# EAGLE design SchematicV2 (EAGLE 7.7.0)
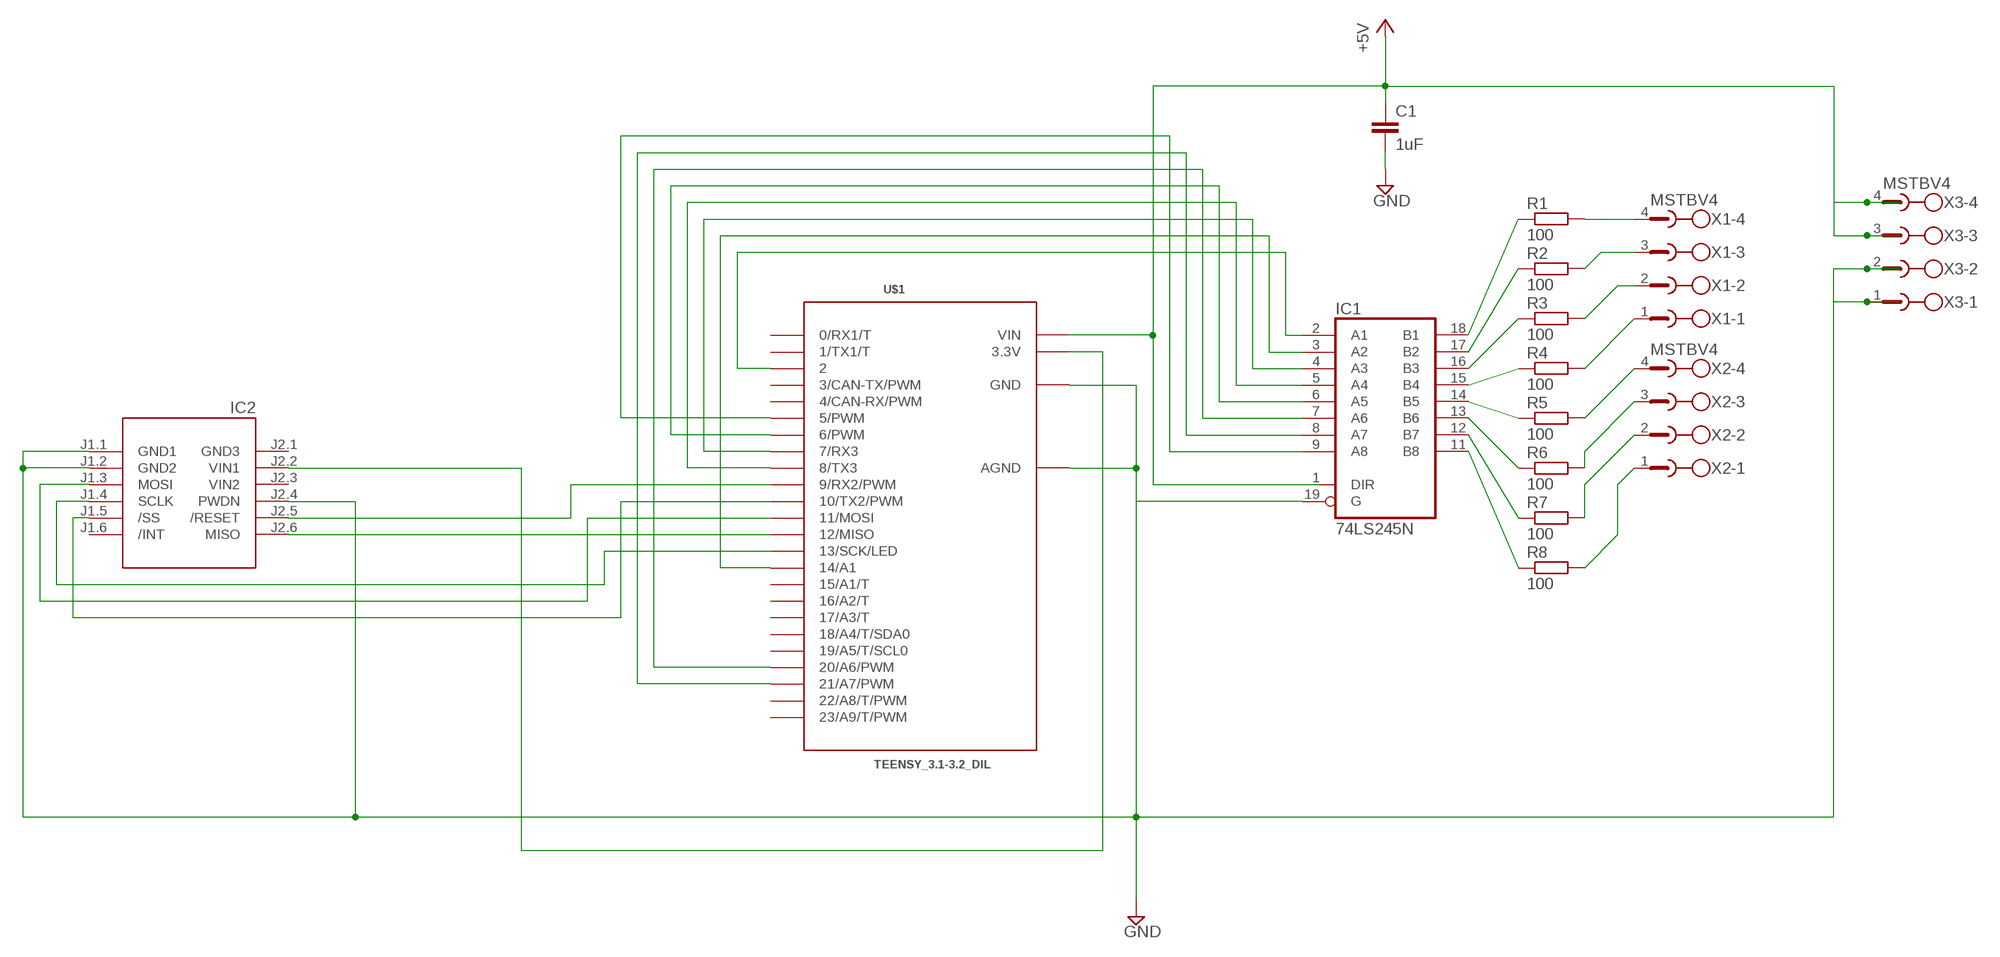
[diagram p0: schematic, sheet 1]

## Parts
C1  1uF  C-EU050-035X075  [C050-035X075]
IC1  74LS245N  [DIL20]
IC2  WIZ820IO_DEVICE'DUAL-IN-LINE'  [WIZ820IO]
R1  100  R-EU_0207/7  [0207/7]
R2  100  R-EU_0207/7  [0207/7]
R3  100  R-EU_0207/7  [0207/7]
R4  100  R-EU_0207/7  [0207/7]
R5  100  R-EU_0207/7  [0207/7]
R6  100  R-EU_0207/7  [0207/7]
R7  100  R-EU_0207/7  [0207/7]
R8  100  R-EU_0207/7  [0207/7]
U$1  TEENSY_3.1-3.2_DIL  [TEENSY_3.0-3.2&LC_DIL]
X1  MSTBV4  [MSTBV4]
X2  MSTBV4  [MSTBV4]
X3  MSTBV4  [MSTBV4]

## Nets
+5V: C1.1 U$1.VIN X3.3 X3.4
GND: C1.2 IC1.19(G) IC2.J1.1(GND1) IC2.J1.2(GND2) IC2.J2.4(PWDN) U$1.AGND U$1.GND X3.1 X3.2
N$1: IC1.18(B1) R1.1
N$2: IC1.17(B2) R2.1
N$3: IC1.16(B3) R3.1
N$4: IC1.15(B4) R4.1
N$5: IC1.14(B5) R5.1
N$6: IC1.13(B6) R6.1
N$7: IC1.12(B7) R7.1
N$8: IC1.11(B8) R8.1
N$9: IC1.2(A1) U$1.2
N$10: IC1.3(A2) U$1.14/A0(14/A1)
N$11: IC1.4(A3) U$1.7(7/RX3)
N$12: IC1.5(A4) U$1.8(8/TX3)
N$13: IC1.6(A5) U$1.6(6/PWM)
N$14: IC1.7(A6) U$1.20/A6(20/A6/PWM)
N$15: IC1.8(A7) U$1.21/A7(21/A7/PWM)
N$16: IC1.9(A8) U$1.5(5/PWM)
N$18: IC2.J2.2(VIN1) U$1.3.3V
N$19: IC2.J2.5(/RESET) U$1.9(9/RX2/PWM)
N$20: IC2.J2.6(MISO) U$1.12(12/MISO)
N$21: IC2.J1.3(MOSI) U$1.11(11/MOSI)
N$22: IC2.J1.4(SCLK) U$1.13(13/SCK/LED)
N$23: IC2.J1.5(/SS) U$1.10(10/TX2/PWM)
N$24: R1.2 X1.4
N$25: R2.2 X1.3
N$26: R3.2 X1.2
N$27: R4.2 X1.1
N$28: R5.2 X2.4
N$29: R6.2 X2.3
N$30: R7.2 X2.2
N$31: R8.2 X2.1
Unconnected: IC1.1(DIR) IC2.J1.6(/INT) U$1.0(0/RX1/T) U$1.1(1/TX1/T) U$1.3(3/CAN-TX/PWM) U$1.4(4/CAN-RX/PWM) U$1.15/A1(15/A1/T) U$1.16/A2(16/A2/T) U$1.17/A3(17/A3/T) U$1.18/A4(18/A4/T/SDA0) U$1.19/A5(19/A5/T/SCL0) U$1.22/A8(22/A8/T/PWM) U$1.23/A9(23/A9/T/PWM)

## Power pins joined to a net without a drawn wire
GND: IC1.10(GND)
GND3: IC2.J2.1(GND3)
VCC: IC1.20(VCC)
VIN2: IC2.J2.3(VIN2)

## Library data of the parts
C1 = resistor:C-EU: CAPACITOR, European symbol
IC1 = 74xx-us:74*245: Octal BUS TRANSCEIVER, 3-state
IC2 = Wiz820io:WIZ820IO_DEVICE: WIZnet, WIZ820io plug in module incl. W5200 chip and MagJack
R1-R8 = resistor:R-EU_: RESISTOR, European symbol
U$1 = Teensy_3_and_LC_Series_Boards_v1.4:TEENSY_3.1-3.2_DIL: Teensy 3.1 or 3.2 in a DIL Layout.
X1-X3 = con-phoenix-508:MSTBV4: PHOENIX; MPN: MSTBV 2,5/4-GF-5.08; OC_FARNELL: 1792794; OC_NEWARK: 69R9847

## Board
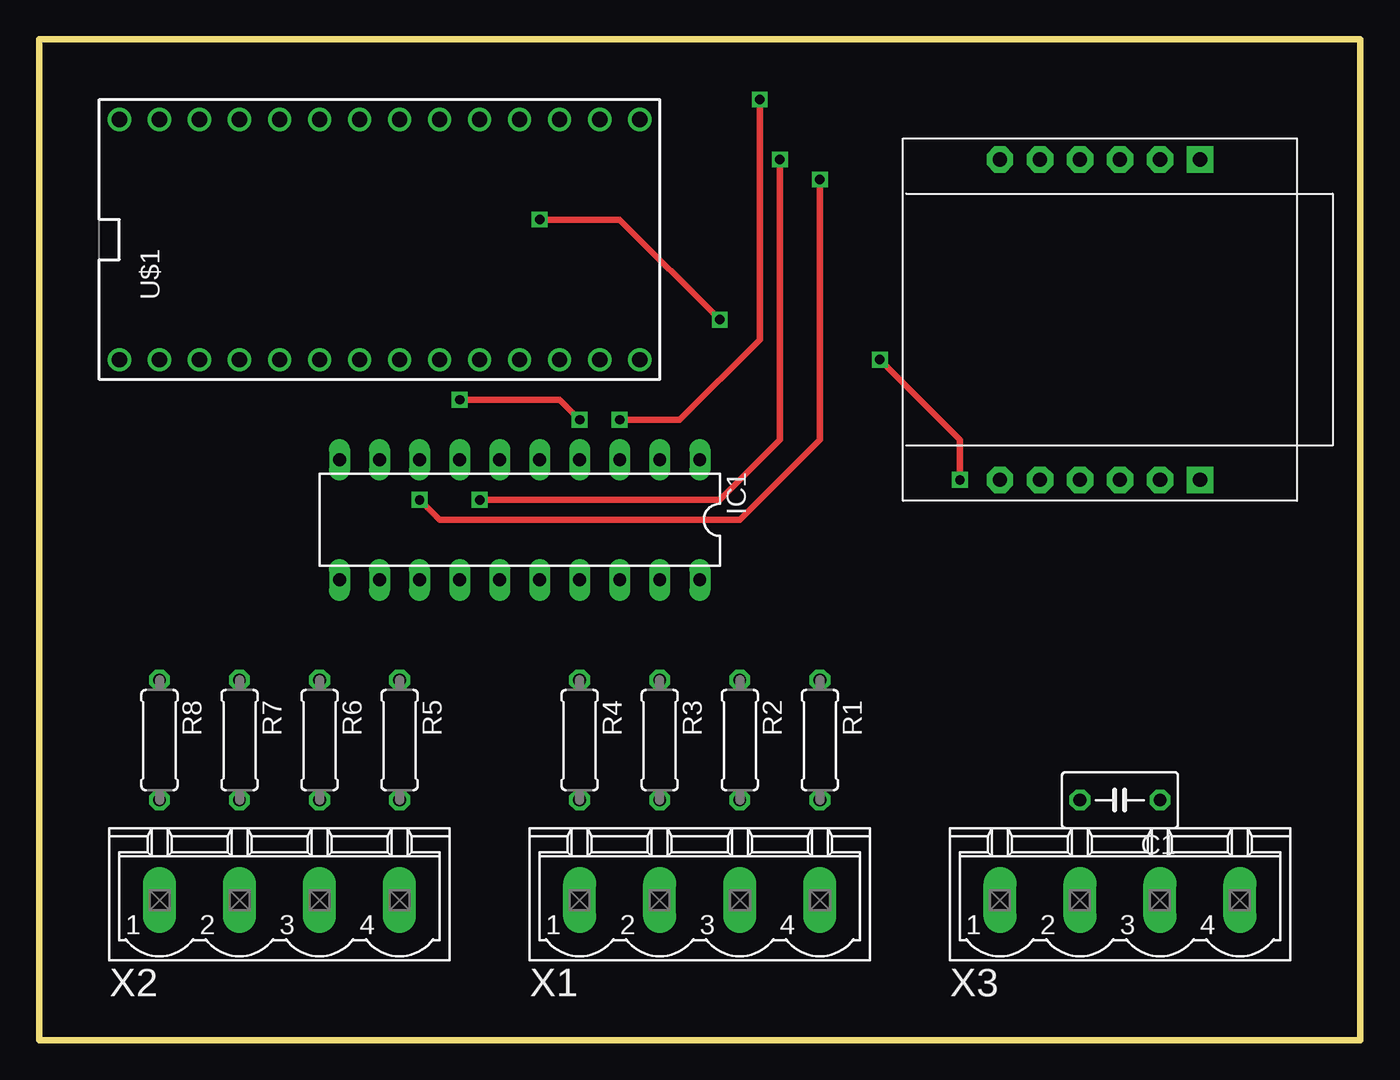
[diagram p1: board, top side]
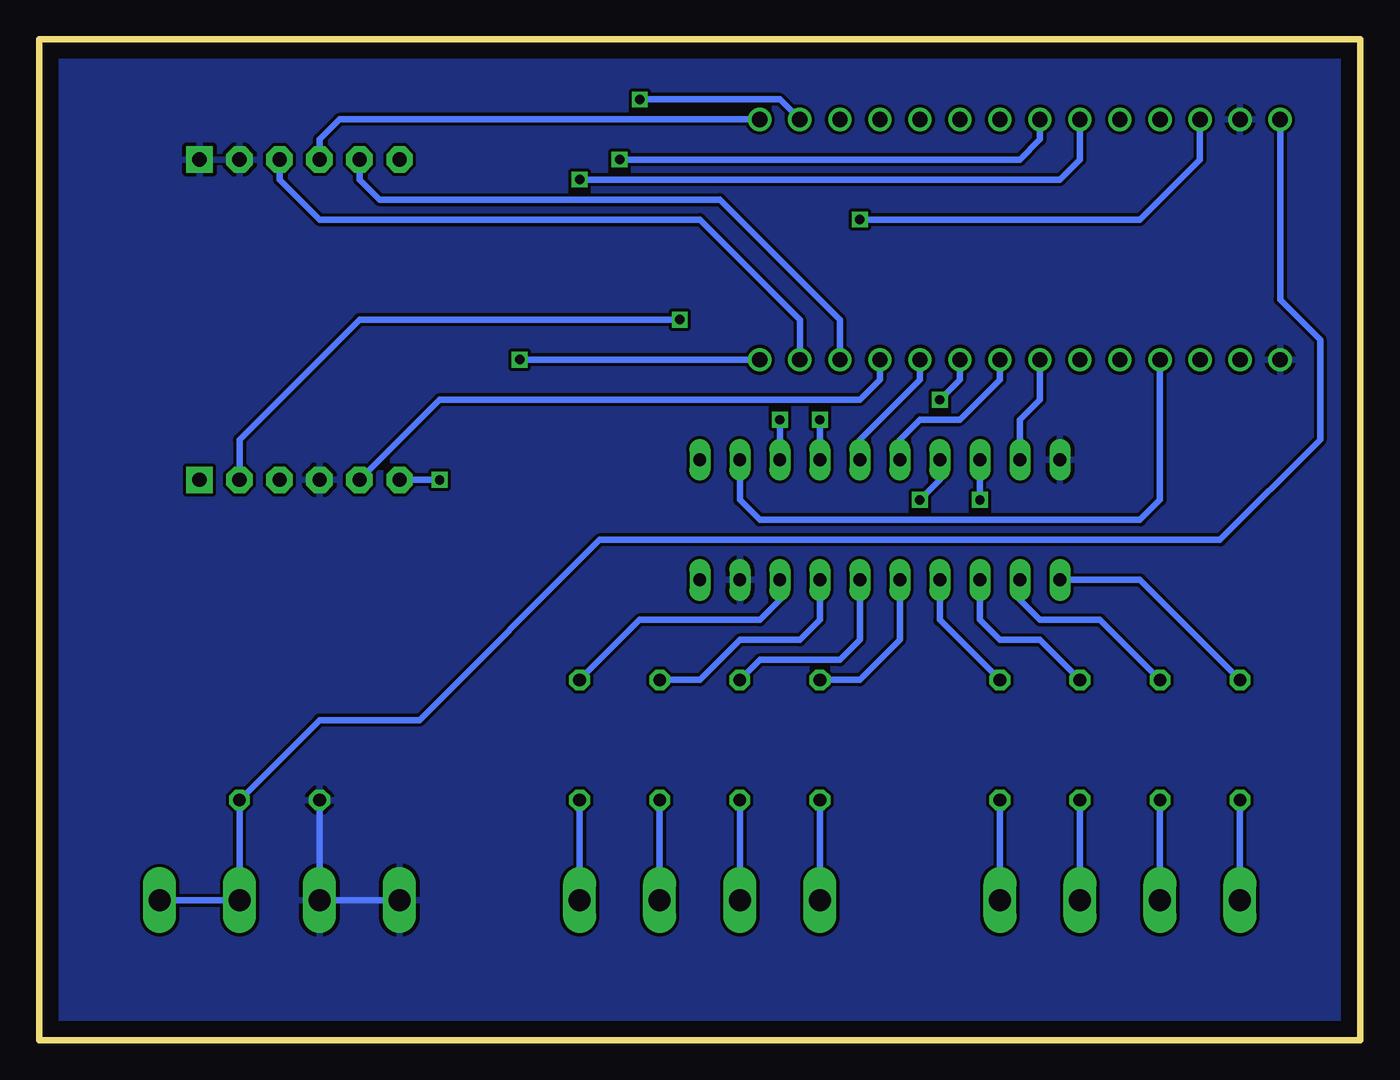
[diagram p2: board, bottom side, seen from below]

Size 83.82 x 63.5 mm. Coordinates in mm from the lower left corner, seen from the top.
Outline: 0,63.5 83.82,63.5 83.82,0 0,0 0,63.5
Copper layers (1*16): Top 0.035mm / dielectric 1.5mm / Bottom 0.035mm
Design rules "default": minimum track width 10mil, minimum drill 24mil, track to track 8mil, track to pad 8mil, pad to pad 8mil, via to via 8mil, smd to smd 8mil, copper to edge 40mil, drill to drill 8mil, minimum pad ring 10mil, minimum via ring 8mil, stop-mask expansion 4mil, vias tented up to drill 0mil, thermal gap 10mil

### Footprints (pad centres in the part's own frame; a part is rotated, then mirrored left to right if it is on the bottom)
C050-035X075 = drill 0.813 octagon: 1 -2.54,0; 2 2.54,0
DIL20 = drill 0.813 long: 1 -11.43,-3.81; 2 -8.89,-3.81; 3 -6.35,-3.81; 4 -3.81,-3.81; 5 -1.27,-3.81; 6 1.27,-3.81; 7 3.81,-3.81; 8 6.35,-3.81; 9 8.89,-3.81; 10 11.43,-3.81; 11 11.43,3.81; 12 8.89,3.81; 13 6.35,3.81; 14 3.81,3.81; 15 1.27,3.81; 16 -1.27,3.81; 17 -3.81,3.81; 18 -6.35,3.81; 19 -8.89,3.81; 20 -11.43,3.81
WIZ820IO = drill 0.9 pad 1.676 square: J1.1 -10.16,6.35; J2.1 10.16,6.35 | drill 0.9 pad 1.676 octagon: J1.2 -10.16,3.81; J1.3 -10.16,1.27; J1.4 -10.16,-1.27; J1.5 -10.16,-3.81; J1.6 -10.16,-6.35; J2.2 10.16,3.81; J2.3 10.16,1.27; J2.4 10.16,-1.27; J2.5 10.16,-3.81; J2.6 10.16,-6.35
0207/7 = drill 0.813 octagon: 1 -3.81,0; 2 3.81,0
TEENSY_3.0-3.2&LC_DIL = drill 0.965: 0 -7.62,13.97; 1 -7.62,11.43; 2 -7.62,8.89; 3 -7.62,6.35; 3.3V 7.62,11.43; 4 -7.62,3.81; 5 -7.62,1.27; 6 -7.62,-1.27; 7 -7.62,-3.81; 8 -7.62,-6.35; 9 -7.62,-8.89; 10 -7.62,-11.43; 11 -7.62,-13.97; 12 -7.62,-16.51; 13 7.62,-16.51; 14/A0 7.62,-13.97; 15/A1 7.62,-11.43; 16/A2 7.62,-8.89; 17/A3 7.62,-6.35; 18/A4 7.62,-3.81; 19/A5 7.62,-1.27; 20/A6 7.62,1.27; 21/A7 7.62,3.81; 22/A8 7.62,6.35; 23/A9 7.62,8.89; AGND 7.62,13.97; GND -7.62,16.51; VIN 7.62,16.51
MSTBV4 = drill 1.397 long: 1 -7.62,0; 2 -2.54,0; 3 2.54,0; 4 7.62,0

### Placement (x,y rotation side)
C1  68.58,15.24 180 top
IC1  30.48,33.02 180 top
IC2  67.31,45.72 270 top
R1  49.53,19.05 270 top
R2  44.45,19.05 270 top
R3  39.37,19.05 270 top
R4  34.29,19.05 270 top
R5  22.86,19.05 270 top
R6  17.78,19.05 270 top
R7  12.7,19.05 270 top
R8  7.62,19.05 270 top
U$1  21.59,50.8 90 top
X1  41.91,8.89 0 top
X2  15.24,8.89 0 top
X3  68.58,8.89 0 top

### Tracks (layer width: path | path; a pad name or v marks a point on that pad's centre or on a via)
+5V
  Bottom 0.406: X3.4 X3.3 C1.1 66.04,20.32 59.69,20.32 48.26,31.75 8.89,31.75 2.54,38.1 2.54,44.45 5.08,46.99 U$1.VIN
GND
  Bottom 0.406: C1.2 X3.2 X3.1
  pour Bottom: 0,63.5 83.82,63.5 83.82,0 0,0
N$1
  Bottom 0.406: IC1.18 36.83,27.94 38.1,26.67 45.72,26.67 R1.1
N$2
  Bottom 0.406: IC1.17 34.29,26.67 35.56,25.4 39.37,25.4 41.91,22.86 R2.1
N$3
  Bottom 0.406: IC1.16 31.75,25.4 33.02,24.13 38.1,24.13 R3.1
N$4
  Bottom 0.406: IC1.15 29.21,25.4 31.75,22.86 R4.1
N$5
  Bottom 0.406: IC1.14 26.67,26.67 R5.1
N$6
  Bottom 0.406: IC1.13 24.13,26.67 22.86,25.4 20.32,25.4 R6.1
N$7
  Bottom 0.406: IC1.12 21.59,27.94 20.32,26.67 16.51,26.67 R7.1
N$8
  Bottom 0.406: IC1.11 13.97,29.21 R8.1
N$9
  Bottom 0.406: U$1.2 12.7,34.29 13.97,33.02 38.1,33.02 39.37,34.29 IC1.2
N$10  (via drill 0.6)
  Top 0.406: v45.72,59.69 45.72,44.45 40.64,39.37 v36.83,39.37
  Bottom 0.406: U$1.14/A0 36.83,59.69 v45.72,59.69 | v36.83,39.37 IC1.3
N$11  (via drill 0.6)
  Top 0.406: v26.67,40.64 33.02,40.64 v34.29,39.37
  Bottom 0.406: U$1.7 25.4,41.91 v26.67,40.64 | v34.29,39.37 IC1.4
N$12
  Bottom 0.406: U$1.8 27.94,41.91 31.75,38.1 IC1.5
N$13
  Bottom 0.406: IC1.6 29.21,38.1 27.94,39.37 25.4,39.37 22.86,41.91 U$1.6
N$14  (via drill 0.6)
  Top 0.406: v46.99,55.88 46.99,38.1 43.18,34.29 v27.94,34.29
  Bottom 0.406: U$1.20/A6 20.32,57.15 21.59,55.88 v46.99,55.88 | v27.94,34.29 26.67,35.56 IC1.7
N$15  (via drill 0.6)
  Top 0.406: v49.53,54.61 49.53,38.1 44.45,33.02 25.4,33.02 v24.13,34.29
  Bottom 0.406: U$1.21/A7 17.78,55.88 19.05,54.61 v49.53,54.61 | v24.13,34.29 IC1.8
N$16
  Bottom 0.406: U$1.5 20.32,40.64 21.59,39.37 IC1.9
N$18  (via drill 0.6)
  Top 0.406: v31.75,52.07 36.83,52.07 v43.18,45.72
  Bottom 0.406: U$1.3.3V 10.16,55.88 13.97,52.07 v31.75,52.07 | v43.18,45.72 63.5,45.72 71.12,38.1 IC2.J2.2
N$19
  Bottom 0.406: U$1.9 30.48,41.91 31.75,40.64 58.42,40.64 IC2.J2.5
N$20  (via drill 0.6)
  Top 0.406: v53.34,43.18 58.42,38.1 v58.42,35.56
  Bottom 0.406: U$1.12 v53.34,43.18 | v58.42,35.56 IC2.J2.6
N$21
  Bottom 0.406: IC2.J1.3 68.58,54.61 66.04,52.07 41.91,52.07 35.56,45.72 U$1.11
N$22
  Bottom 0.406: U$1.13 64.77,58.42 66.04,57.15 IC2.J1.4
N$23
  Bottom 0.406: IC2.J1.5 63.5,54.61 62.23,53.34 40.64,53.34 33.02,45.72 U$1.10
N$24
  Bottom 0.406: R1.2 X1.4
N$25
  Bottom 0.406: R2.2 X1.3
N$26
  Bottom 0.406: R3.2 X1.2
N$27
  Bottom 0.406: R4.2 X1.1
N$28
  Bottom 0.406: R5.2 X2.4
N$29
  Bottom 0.406: R6.2 X2.3
N$30
  Bottom 0.406: R7.2 X2.2
N$31
  Bottom 0.406: R8.2 X2.1